# EAGLE design RasPi-BplusHAT (EAGLE 9.6.1)
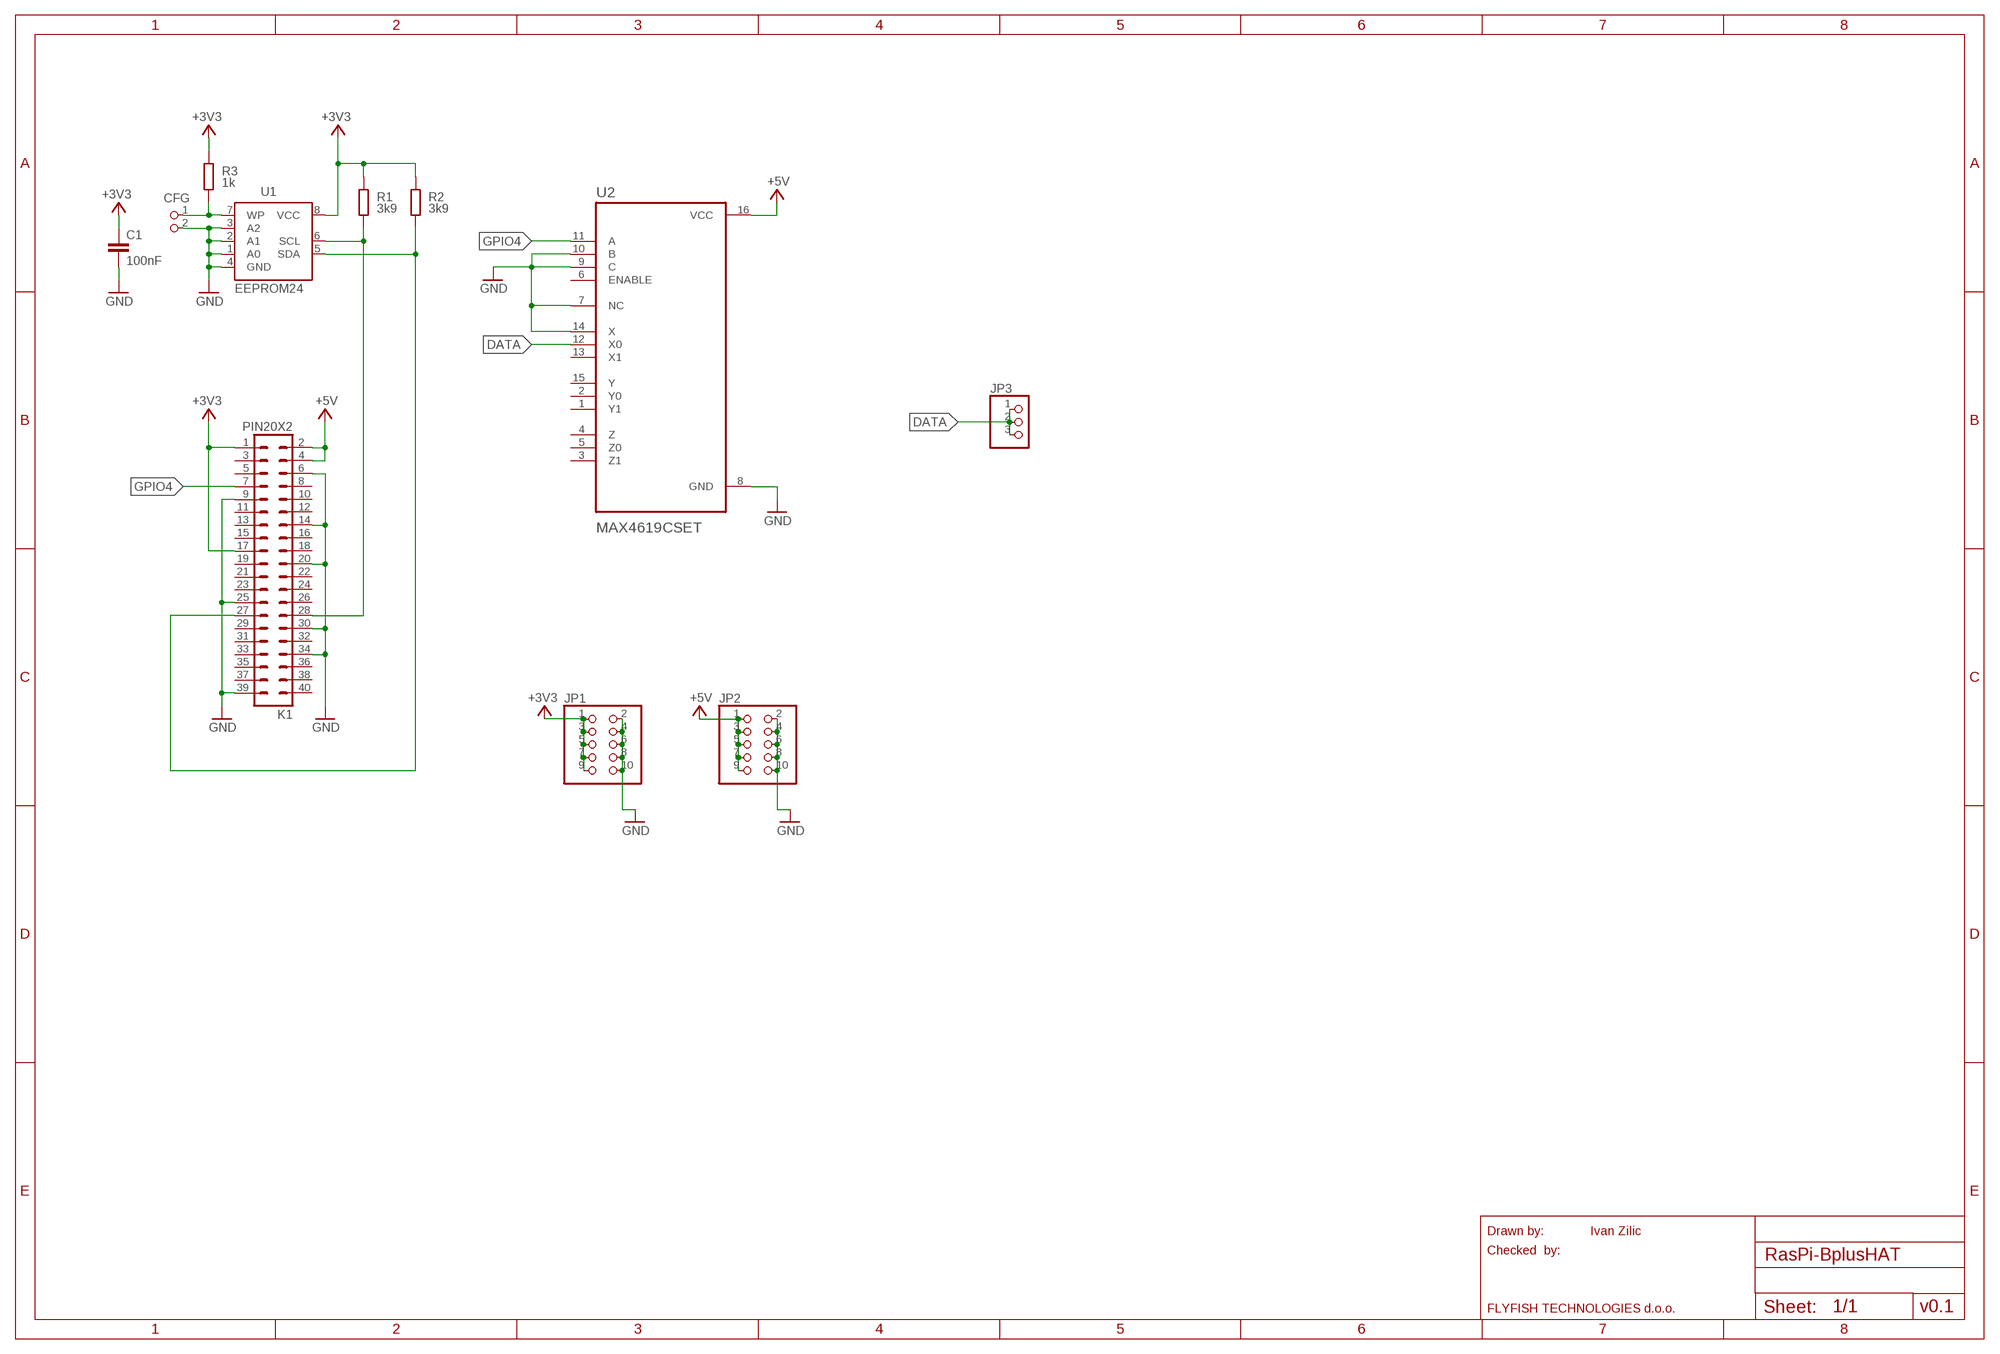
[diagram p0: schematic, sheet 1]

## Parts
C1  100nF  C-EUC0805K  [C0805K]
CFG  PIN2_100  [PIN_W_2]
JP1  PINHD-2X5  [2X05]
JP2  PINHD-2X5  [2X05]
JP3  PINHD-1X3  [1X03]
K1  PIN20X2  [PIN_20X2]
R1  3k9  R-EU_M0805  [M0805]
R2  3k9  R-EU_M0805  [M0805]
R3  1k  R-EU_M0805  [M0805]
U1  EEPROM24  [SOIC8]
U2  MAX4619CSET  [SOIC127P600X175-16N]

## Nets
+3V3: C1.1 JP1.1 JP1.3 JP1.5 JP1.7 JP1.9 K1.1 K1.17 R1.2 R2.2 R3.2 U1.8(VCC)
+5V: JP2.1 JP2.3 JP2.5 JP2.7 JP2.9 K1.2 K1.4 U2.16(VCC)
DATA: JP3.1 JP3.2 JP3.3 U2.12(X0)
GND: C1.2 CFG.2 JP1.2 JP1.4 JP1.6 JP1.8 JP1.10 JP2.2 JP2.4 JP2.6 JP2.8 JP2.10 K1.6 K1.9 K1.14 K1.20 K1.25 K1.30 K1.34 K1.39 U1.1(A0) U1.2(A1) U1.3(A2) U1.4(GND) U2.7(NC) U2.8(GND) U2.9(C) U2.10(B) U2.14(X)
GPIO4: K1.7 U2.11(A)
N$1: K1.28 R1.1 U1.6(SCL)
N$2: K1.27 R2.1 U1.5(SDA)
N$3: CFG.1 R3.1 U1.7(WP)
Unconnected: K1.3 K1.5 K1.8 K1.10 K1.11 K1.12 K1.13 K1.15 K1.16 K1.18 K1.19 K1.21 K1.22 K1.23 K1.24 K1.26 K1.29 K1.31 K1.32 K1.33 K1.35 K1.36 K1.37 K1.38 K1.40 U2.1(Y1) U2.2(Y0) U2.3(Z1) U2.4(Z) U2.5(Z0) U2.6(ENABLE) U2.13(X1) U2.15(Y)

## Notes on the sheet
- Drawn by: | Ivan Zilic
- Checked  by:
- FLYFISH TECHNOLOGIES d.o.o. | v0.1

## Library data of the parts
C1 = resistor:C-EU: CAPACITOR, European symbol; DIELECTRIC: X7R
CFG = FLYFISH:PIN2
JP1 JP2 = pinhead:PINHD-2X5: PIN HEADER
JP3 = pinhead:PINHD-1X3: PIN HEADER
K1 = FLYFISH:PIN20X2
R1-R3 = resistor:R-EU_: RESISTOR, European symbol; TOLERANCE: 5%
U1 = FLYFISH:EEPROM24
U2 = MAX4619CSET:MAX4619CSET; DESCRIPTION: 3 Circuit IC Switch 2:1 10Ohm 16-SOIC; DIGI-KEY_PART_NUMBER: MAX4619CSE+T-ND; MF: Maxim Integrated; MP: MAX4619CSE+; PACKAGE: SOIC-16 Maxim; PURCHASE-URL: https://pricing.snapeda.com/search/part/MAX4619CSE+/?ref=eda

## Board
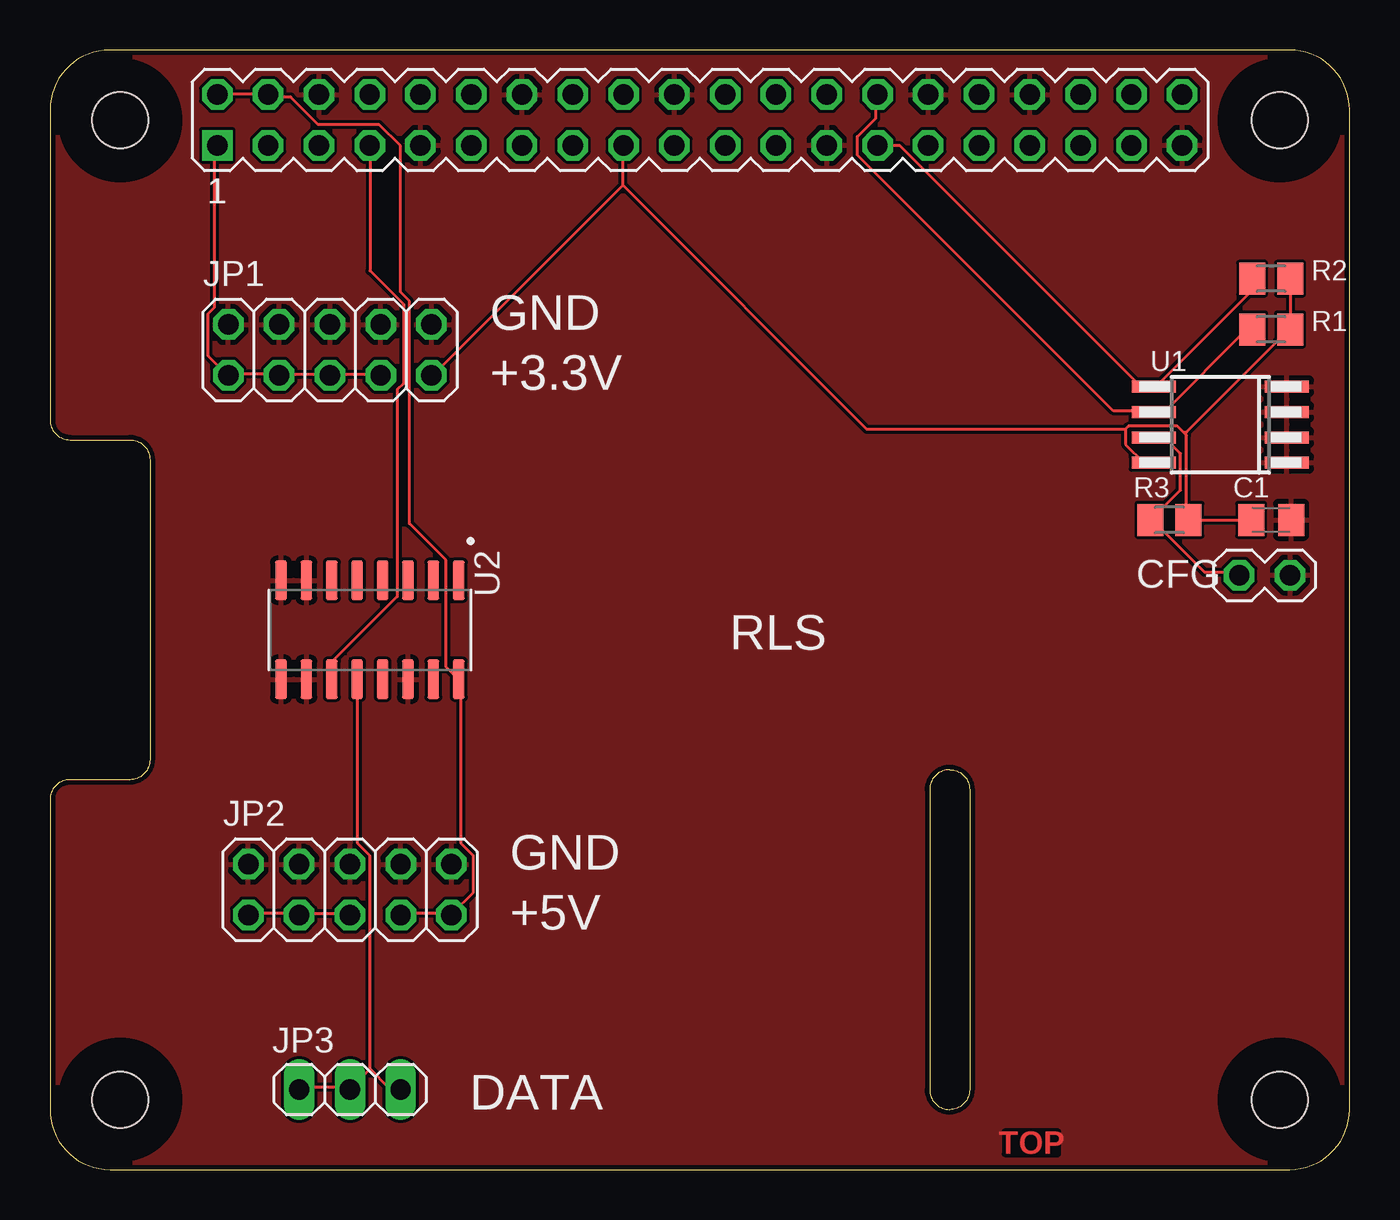
[diagram p1: board, top side]
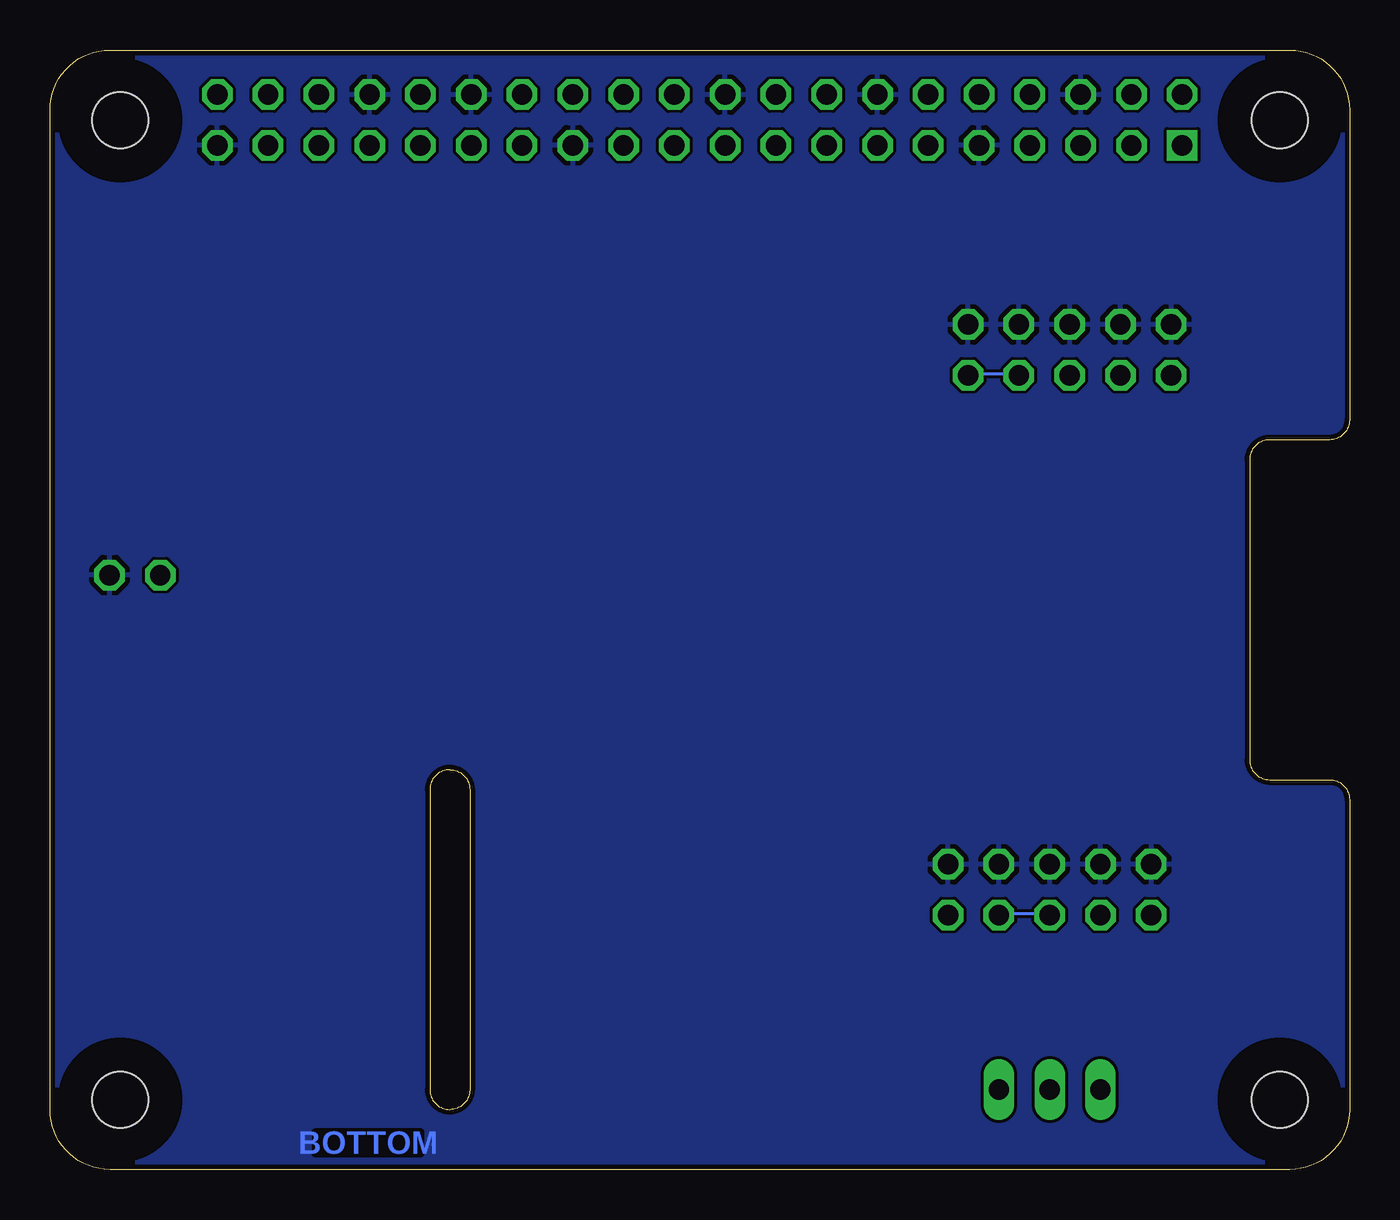
[diagram p2: board, bottom side, seen from below]

Size 65 x 56 mm. Coordinates in mm from the lower left corner, seen from the top.
Outline: 0,3 arc90 3,0 62,0 arc90 65,3 65,53 arc90 62,56 3,56 arc90 0,53 0,37.5 arc90 1,36.5 4,36.5 arc-90 5,35.5 5,20.5 arc-90 4,19.5 1,19.5 arc90 0,18.5 0,3
Outline: 44,19 44,4 arc90 45,3 arc90 46,4 46,19 arc90 45,20 arc90 44,19
Copper layers (1*16): Top 0.035mm / dielectric 1.5mm / Bottom 0.035mm
Design rules "ITEADstudio_DRC": minimum track width 6mil, minimum drill 12mil, track to track 6mil, track to pad 6mil, pad to pad 6mil, via to via 6mil, smd to smd 0mil, copper to edge 10mil, drill to drill 10mil, minimum pad ring 10mil, minimum via ring 6mil, stop-mask expansion 2mil, vias tented up to drill 100mil, thermal gap 10mil
Holes 2.8 mm at 3.5,3.5 3.5,52.5 61.5,52.5 61.5,3.5
tRestrict: area 1.9,51 to 5,54; area 60,51 to 63,54; area 60,1.9 to 63,5; area 1.9,1.9 to 5,5
bRestrict: area 1.9,1.9 to 5,5; area 1.9,51 to 5,54; area 60,1.9 to 63,5; area 60,51 to 63,54
Milling: 6 lines

### Footprints (pad centres in the part's own frame; a part is rotated, then mirrored left to right if it is on the bottom)
C0805K = smd 1.3 x 1.6: 1 -1,0; 2 1,0
PIN_W_2 = drill 1.016 octagon: 1 0,0; 2 0,-2.54
2X05 = drill 1.016 octagon: 1 -5.08,-1.27; 2 -5.08,1.27; 3 -2.54,-1.27; 4 -2.54,1.27; 5 0,-1.27; 6 0,1.27; 7 2.54,-1.27; 8 2.54,1.27; 9 5.08,-1.27; 10 5.08,1.27
1X03 = drill 1.016 long: 1 -2.54,0; 2 0,0; 3 2.54,0
PIN_20X2 = drill 1.016 square: 1 -24.13,-1.27 | drill 1.016 octagon: 2 -24.13,1.27; 3 -21.59,-1.27; 4 -21.59,1.27; 5 -19.05,-1.27; 6 -19.05,1.27; 7 -16.51,-1.27; 8 -16.51,1.27; 9 -13.97,-1.27; 10 -13.97,1.27; 11 -11.43,-1.27; 12 -11.43,1.27; 13 -8.89,-1.27; 14 -8.89,1.27; 15 -6.35,-1.27; 16 -6.35,1.27; 17 -3.81,-1.27; 18 -3.81,1.27; 19 -1.27,-1.27; 20 -1.27,1.27; 21 1.27,-1.27; 22 1.27,1.27; 23 3.81,-1.27; 24 3.81,1.27; 25 6.35,-1.27; 26 6.35,1.27; 27 8.89,-1.27; 28 8.89,1.27; 29 11.43,-1.27; 30 11.43,1.27; 31 13.97,-1.27; 32 13.97,1.27; 33 16.51,-1.27; 34 16.51,1.27; 35 19.05,-1.27; 36 19.05,1.27; 37 21.59,-1.27; 38 21.59,1.27; 39 24.13,-1.27; 40 24.13,1.27
M0805 = smd 1.3 x 1.6: 1 -0.95,0; 2 0.95,0
SOIC8 = smd 0.6 x 2.2: 1 -1.905,-3.33; 2 -0.635,-3.33; 3 0.635,-3.33; 4 1.905,-3.33; 5 1.905,3.33; 6 0.635,3.33; 7 -0.635,3.33; 8 -1.905,3.33
SOIC127P600X175-16N = smd 1.97 x 0.59: 1 -2.475,4.445; 2 -2.475,3.175; 3 -2.475,1.905; 4 -2.475,0.635; 5 -2.475,-0.635; 6 -2.475,-1.905; 7 -2.475,-3.175; 8 -2.475,-4.445; 9 2.475,-4.445; 10 2.475,-3.175; 11 2.475,-1.905; 12 2.475,-0.635; 13 2.475,0.635; 14 2.475,1.905; 15 2.475,3.175; 16 2.475,4.445

### Placement (x,y rotation side)
C1  61.08,32.5 0 top
CFG  59.48,29.73 90 top
JP1  14,41 0 top
JP2  15,14 0 top
JP3  15,4 0 top
K1  32.5,52.5 0 top
R1  61.08,42.02 0 top
R2  61.08,44.56 0 top
R3  55.99,32.5 0 top
U1  58.53,37.26 90 top
U2  16,27 270 top

### Tracks (layer width: path | path; a pad name or v marks a point on that pad's centre or on a via)
+3V3
  Top 0.152: R2.2 62.03,44.5 62.03,42.06 R1.2 61.87,41.91 56.84,36.88 56.69,36.88 | C1.1 60.05,32.46 57,32.46 R3.2 56.84,32.61 56.84,36.73 56.69,36.88 | 53.8,37.03 53.8,36.27 54.71,35.36 55.17,35.36 U1.8 | 53.8,37.03 53.95,37.19 56.39,37.19 56.69,36.88 | JP1.7 16.46,39.78 14.02,39.78 JP1.5 13.87,39.78 11.58,39.78 JP1.3 11.43,39.78 8.99,39.78 JP1.1 8.84,39.78 7.92,40.69 7.92,42.82 8.23,43.13 8.23,51.21 K1.1 | 28.65,49.23 28.65,51.21 K1.17 | 28.65,49.23 19.2,39.78 JP1.9 | 53.8,37.03 40.84,37.03 28.65,49.23
  Bottom 0.152: JP1.9 19.05,39.78 16.61,39.78 JP1.7
+5V
  Top 0.152: JP2.1 10.06,12.8 12.34,12.8 JP2.3 12.5,12.8 14.94,12.8 JP2.5 | K1.2 8.38,53.8 10.82,53.8 K1.4 10.97,53.65 12.04,53.65 13.41,52.27 16.46,52.27 17.53,51.21 17.53,43.89 17.98,43.43 17.98,32.31 19.81,30.48 19.81,25.15 20.42,24.54 U2.16 20.57,24.38 20.57,16.31 21.18,15.7 21.18,13.87 20.12,12.8 JP2.9 19.96,12.8 17.68,12.8 JP2.7
  Bottom 0.152: JP2.5 15.09,12.8 17.53,12.8 JP2.7
DATA
  Top 0.152: 16,5.03 16,15.7 15.39,16.31 15.39,24.38 U2.12 | 16,5.03 15.09,4.12 JP3.2 14.94,4.12 12.5,4.12 JP3.1 | 16,5.03 16.92,4.12 17.53,4.12 JP3.3
GND
  pour Bottom: 0,3 arc90 3,0 62,0 arc90 65,3 65,53 arc90 62,56 3,56 arc90 0,53 0,37.5 arc90 1,36.5 4,36.5 arc-90 5,35.5 5,20.5 arc-90 4,19.5 1,19.5 arc90 0,18.5
  pour Top: 0,3 arc90 3,0 62,0 arc90 65,3 65,53 arc90 62,56 3,56 arc90 0,53 0,37.5 arc90 1,36.5 4,36.5 arc-90 5,35.5 5,20.5 arc-90 4,19.5 1,19.5 arc90 0,18.5
GPIO4
  Top 0.152: U2.11 14.17,24.54 14.17,25.45 17.37,28.65 17.37,39.01 17.68,39.32 17.68,43.28 16,44.96 16,51.21 K1.7
N$1
  Top 0.152: R1.1 60.05,41.91 59.74,41.91 55.78,37.95 55.32,37.95 U1.6 55.17,37.95 53.19,37.95 40.39,50.75 40.39,51.66 41.3,52.58 41.3,53.65 K1.28
N$2
  Top 0.152: R2.1 60.05,44.5 60.05,43.89 55.32,39.17 U1.5 55.17,39.17 54.56,39.17 42.52,51.21 41.45,51.21 K1.27
N$3
  Top 0.152: CFG.1 59.44,29.87 57.76,29.87 55.17,32.46 R3.1 55.17,32.61 56.54,33.98 56.54,35.81 55.78,36.58 55.32,36.58 U1.7

### Text on the board
Top: TOP
Bottom: BOTTOM
tPlace: GND | +3.3V | RLS | GND | +5V | DATA